# Altium project Busmaster.PrjPcb
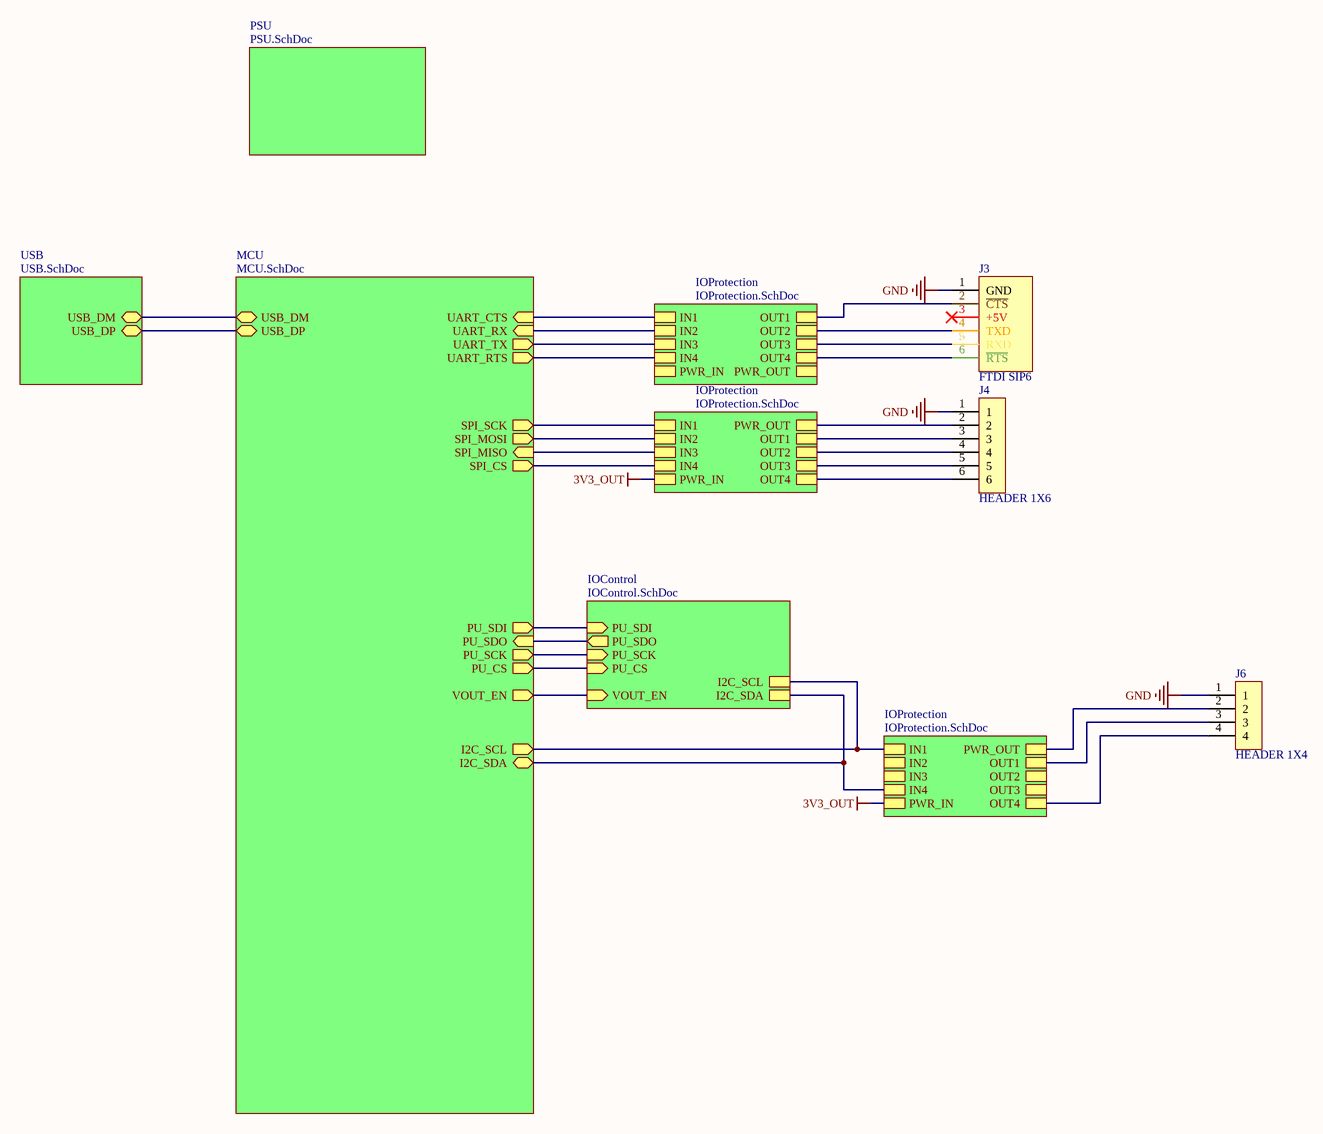
[diagram p0: Busmaster.SchDoc]
Project_Revision: 1.0; Project_Board_Name: Busmaster
6 sheets, 59 parts. Net scope: hierarchical (ports join the sheet entries above them; power ports are global).
Board file: Busmaster.PcbDoc
Sheets:
  Busmaster.SchDoc
    MCU = MCU.SchDoc
    PSU = PSU.SchDoc
    USB = USB.SchDoc
    IOProtection = IOProtection.SchDoc
    IOProtection = IOProtection.SchDoc
    IOProtection = IOProtection.SchDoc
    IOControl = IOControl.SchDoc

## Sheet Busmaster.SchDoc: Top Level
size A3; CompanyName: NOT USED; SheetNumber: 0; SheetTotal: 0; PageSetup: Record=PageOptions|CenterHorizontal=True|CenterVertical=True|PrintScale=1.00|XCorrection=1.00|YCorrection=1.00|PrintKind=0|BorderSize=5000000|LeftOffset=0|BottomOffset=0|Orientation=2|PaperLength=1000|PaperWidth=1000|Scale=100|PaperSource=7|PrintQuality=-4|MediaType=1|DitherType=10|PaperKind=A3|PrintScaleMode=0

### Parts
J3  FTDI SIP6  [HIROSE_A2-6PA-2.54DSA]
J4  HEADER 1X6  [HIROSE_A2-6PA-2.54DSA]
J6  HEADER 1X4  [HIROSE_A2-4PA-2.54DSA]

### Sub-sheets
IOControl = IOControl.SchDoc: VOUT_EN (in), I2C_SCL, I2C_SDA, PU_SDI (in), PU_SDO (out), PU_CS (in), PU_SCK (in)
IOProtection = IOProtection.SchDoc: IN2, OUT4, IN1, OUT1, IN3, IN4, OUT2, OUT3, PWR_IN, PWR_OUT
IOProtection = IOProtection.SchDoc: IN2, OUT4, IN1, OUT1, IN3, IN4, OUT2, OUT3, PWR_IN, PWR_OUT
IOProtection = IOProtection.SchDoc: IN2, OUT4, IN1, OUT1, IN3, IN4, OUT2, OUT3, PWR_OUT, PWR_IN
MCU = MCU.SchDoc: USB_DM (bidir), UART_CTS (in), SPI_CS (out), USB_DP (bidir), I2C_SCL (out), I2C_SDA (bidir), UART_RX (in), SPI_MOSI (out), UART_RTS (out), SPI_MISO (in), UART_TX (out), SPI_SCK (out), VOUT_EN (out), PU_SDI (out), PU_SDO (in), PU_SCK (out), PU_CS (out)
PSU = PSU.SchDoc: no entries
USB = USB.SchDoc: USB_DM (bidir), USB_DP (bidir)

### Nets
3V3_OUT: sheet IOProtection/PWR_IN, sheet IOProtection/PWR_IN
GND: J3.1(GND) J4.1 J6.1
NetC10_1#2_2: J6.2 ; sheet IOProtection/PWR_OUT
NetC10_2_2: J4.2 ; sheet IOProtection/PWR_OUT
NetD2_4: sheet MCU/USB_DP, sheet USB/USB_DP
NetD2_6: sheet MCU/USB_DM, sheet USB/USB_DM
NetD4_1_1: sheet MCU/I2C_SCL, sheet IOProtection/IN1, sheet IOControl/I2C_SCL
NetD4_1_3: sheet MCU/I2C_SDA, sheet IOProtection/IN4, sheet IOControl/I2C_SDA
NetD4_2_1: sheet MCU/SPI_SCK, sheet IOProtection/IN1
NetD4_2_3: sheet MCU/SPI_CS, sheet IOProtection/IN4
NetD4_2_4: sheet MCU/SPI_MISO, sheet IOProtection/IN3
NetD4_2_6: sheet MCU/SPI_MOSI, sheet IOProtection/IN2
NetD4_3_1: sheet MCU/UART_CTS, sheet IOProtection/IN1
NetD4_3_3: sheet MCU/UART_RTS, sheet IOProtection/IN4
NetD4_3_4: sheet MCU/UART_TX, sheet IOProtection/IN3
NetD4_3_6: sheet MCU/UART_RX, sheet IOProtection/IN2
NetJ3_2: J3.2(~{CTS}) ; sheet IOProtection/OUT1
NetJ3_4: J3.4(TXD) ; sheet IOProtection/OUT2
NetJ3_5: J3.5(RXD) ; sheet IOProtection/OUT3
NetJ3_6: J3.6(~{RTS}) ; sheet IOProtection/OUT4
NetJ4_3: J4.3 ; sheet IOProtection/OUT1
NetJ4_4: J4.4 ; sheet IOProtection/OUT2
NetJ4_5: J4.5 ; sheet IOProtection/OUT3
NetJ4_6: J4.6 ; sheet IOProtection/OUT4
NetJ6_3: J6.3 ; sheet IOProtection/OUT1
NetJ6_4: J6.4 ; sheet IOProtection/OUT4
NetQ5_1: sheet MCU/VOUT_EN, sheet IOControl/VOUT_EN
NetU1_10: sheet MCU/PU_SDO, sheet IOControl/PU_SDO
NetU1_11: sheet MCU/PU_CS, sheet IOControl/PU_CS
NetU1_12: sheet MCU/PU_SCK, sheet IOControl/PU_SCK
NetU1_13: sheet MCU/PU_SDI, sheet IOControl/PU_SDI

Not connected (* = marked no-connect by the designer): J3 3(+5V)*

### Notes on the sheet
- Project
- Size:
- Date:
- A3
- Revision:
- Sheet
- of
- Lambo
- File:

### Library data of the parts
J3 = CON-10749-A: FTDI Serial Header; Manufacturer: Hirose Electric Co Ltd; Manufacturer Part Number: A2-6PA-2.54DSA(71); Contacts: 6; Pitch: 2.54mm; Rows: 1; Display_Name: FTDI SIP6; Type: Header; BWA PN: CON-10749-A; Schematic Symbol: FTDI_TTL_232R; Supplier 1: Digi-Key; Supplier Part Number 1: H123043-ND
J4 = CON-10040-A: CONN 6-pin 2.54mm pitch TH single row; Manufacturer: Hirose; Manufacturer Part Number: A2-6PA-2.54DSA; Contacts: 6; Rows: 1; Display_Name: HEADER 1X6; Pitch: 2.54mm; Type: HEADER; BWA PN: CON-10040-A; Schematic Symbol: HIROSE_A2-6PA-2.54DSA
J6 = CON-10039-A: CONN 4-pin 2.54mm pitch TH single row; Manufacturer: Hirose; Manufacturer Part Number: A2-4PA-2.54DSA; Contacts: 4; Rows: 1; Display_Name: HEADER 1X4; Pitch: 2.54mm; BWA PN: CON-10039-A; Schematic Symbol: HIROSE_A2-4PA-2.54DSA

## Sheet MCU.SchDoc: Top Level
size A3; CompanyName: NOT USED; SheetNumber: 0; SheetTotal: 0; PageSetup: Record=PageOptions|CenterHorizontal=True|CenterVertical=True|PrintScale=1.00|XCorrection=1.00|YCorrection=1.00|PrintKind=0|BorderSize=5000000|LeftOffset=0|BottomOffset=0|Orientation=2|PaperLength=1000|PaperWidth=1000|Scale=100|PaperSource=7|PrintQuality=-4|MediaType=1|DitherType=10|PaperKind=A3|PrintScaleMode=0
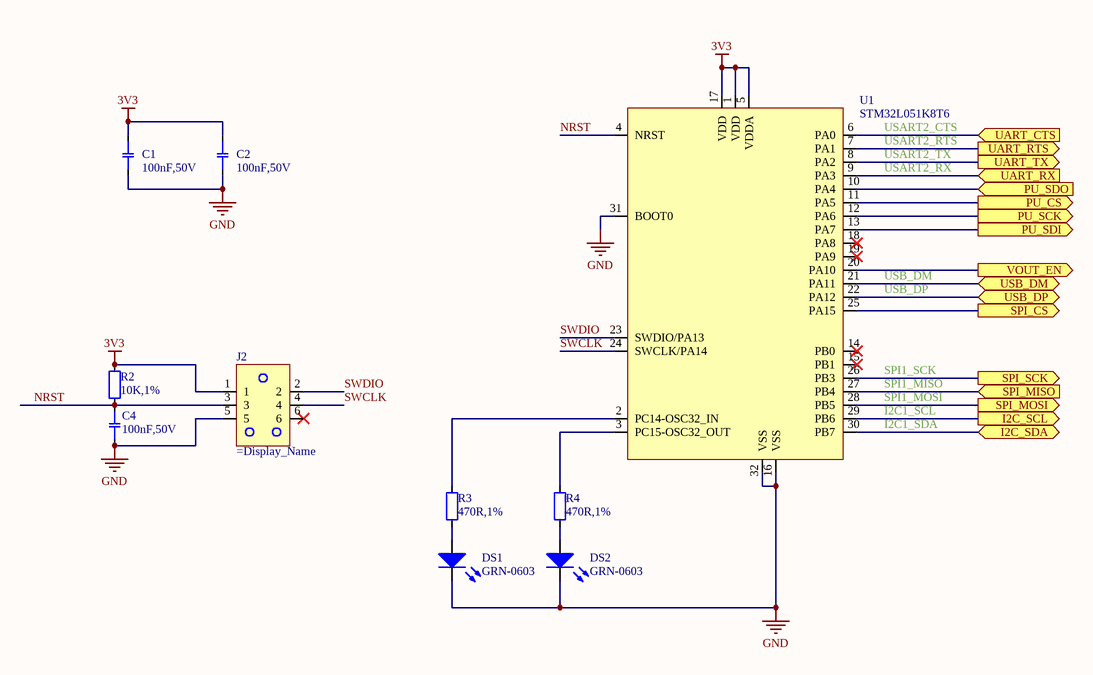
[diagram p1: MCU.SchDoc]

### Parts
C1  100nF,50V  [CAPC1608X09N_0603]
C2  100nF,50V  [CAPC1608X09N_0603]
C4  100nF,50V  [CAPC1608X09N_0603]
DS1  GRN-0603  [LED_SML-LX0603]
DS2  GRN-0603  [LED_SML-LX0603]
J2  (no value)  [TAG-CONNECT_TC2030-IDC]  (no BOM)
R2  10K,1%  [RESC1608X06N_0603]
R3  470R,1%  [RESC1608X06N_0603]
R4  470R,1%  [RESC1608X06N_0603]
U1  STM32L051K8T6  [LQFP32]

### Ports
I2C_SCL (out), I2C_SDA (bidir), PU_CS (out), PU_SCK (out), PU_SDI (out), PU_SDO (in), SPI_CS (out), SPI_MISO (in), SPI_MOSI (out), SPI_SCK (out), UART_CTS (in), UART_RTS (out), UART_RX (in), UART_TX (out), USB_DM (bidir), USB_DP (bidir), VOUT_EN (out)

### Nets
3V3: C1.2 C2.2 J2.1 R2.2 U1.1(VDD) U1.5(VDDA) U1.17(VDD)
GND: C1.1 C2.1 C4.2 DS1.1(C) DS2.1(C) J2.5 U1.16(VSS) U1.31(BOOT0) U1.32(VSS)
NRST: C4.1 J2.3 R2.1 U1.4(NRST)
SWCLK: J2.4 U1.24(SWCLK/PA14)
SWDIO: J2.2 U1.23(SWDIO/PA13)
NetD2_4: U1.22(PA12) ; port USB_DP
NetD2_6: U1.21(PA11) ; port USB_DM
NetD4_1_1: U1.29(PB6) ; port I2C_SCL
NetD4_1_3: U1.30(PB7) ; port I2C_SDA
NetD4_2_1: U1.26(PB3) ; port SPI_SCK
NetD4_2_3: U1.25(PA15) ; port SPI_CS
NetD4_2_4: U1.27(PB4) ; port SPI_MISO
NetD4_2_6: U1.28(PB5) ; port SPI_MOSI
NetD4_3_1: U1.6(PA0) ; port UART_CTS
NetD4_3_3: U1.7(PA1) ; port UART_RTS
NetD4_3_4: U1.8(PA2) ; port UART_TX
NetD4_3_6: U1.9(PA3) ; port UART_RX
NetDS1_2: DS1.2(A) R3.1
NetDS2_2: DS2.2(A) R4.1
NetQ5_1: U1.20(PA10) ; port VOUT_EN
NetR3_2: R3.2 U1.2(PC14-OSC32_IN)
NetR4_2: R4.2 U1.3(PC15-OSC32_OUT)
NetU1_10: U1.10(PA4) ; port PU_SDO
NetU1_11: U1.11(PA5) ; port PU_CS
NetU1_12: U1.12(PA6) ; port PU_SCK
NetU1_13: U1.13(PA7) ; port PU_SDI

Not connected (* = marked no-connect by the designer): J2 6*; U1 14(PB0)* 15(PB1)* 18(PA8)* 19(PA9)*

### Notes on the sheet
- (near U1) USART2_CTS
- (near U1) USART2_RTS
- (near U1) USART2_TX
- (near U1) USART2_RX
- (near U1) USB_DM
- (near U1) USB_DP
- (near U1) SPI1_SCK
- (near U1) SPI1_MISO
- (near U1) SPI1_MOSI
- (near U1) I2C1_SCL
- (near U1) I2C1_SDA
- Project
- Size:
- Date:
- A3
- Revision:
- Sheet
- of
- Lambo
- File:

### Library data of the parts
C1 C2 C4 = CCH-104CH-G: CAP CER 0.1UF 50V 10% X7R 0603; Manufacturer: Kemet; Manufacturer Part Number: C0603C104K5RACTU; Type: Ceramic; Display_Name: 100nF,50V; Capacitance: 100nF; Dielectric: X7R; Tolerance: 10%; Voltage: 50V; BWA PN: CCH-104CH-G; Schematic Symbol: CAP-NP_1; Supplier 1: Digi-Key; Supplier Part Number 1: 399-5089-1-ND
DS1 DS2 = LED-10087-A: LED GREEN CLEAR 0603 SMD; Manufacturer: Dialight; Manufacturer Part Number: 5988081107F; Wavelength: 523nm; Axial Intensity: 300mcd; If(max): 20mA; Lens Style/Size: 0603; Vf@I: 3.2V; Viewing Angle: 140; Display_Name: GRN-0603; BWA PN: LED-10087-A; Colour: GREEN; Lens type: clear; Vr(max): -; Schematic Symbol: LED_1; Supplier 1: Digi-Key; Supplier Part Number 1: 350-2036-1-ND
J2 = NONPART-051: Tag connect 6 way; Schematic Symbol: TAGCON_TC2030-IDC; BWA PN: NONPART-051
R2 = RSH-10K00-D: RES 10.0K OHM 1/10W 1% 0603 SMD; Manufacturer: Yageo; Manufacturer Part Number: RC0603FR-0710KL; Power: 0.1W; Display_Name: 10K,1%; Resistance: 10K; Tolerance: 1%; Type: Chip; BWA PN: RSH-10K00-D; Schematic Symbol: RESISTOR_1; Supplier 1: Digi-Key; Supplier Part Number 1: 311-10.0KHRCT-ND
R3 R4 = RSH-470R0-D: RES 470 OHM 1/10W 1% 0603 SMD; Manufacturer: Rohm Semiconductor; Manufacturer Part Number: MCR03EZPFX4700; Power: 0.1W; Display_Name: 470R,1%; Resistance: 470R; Tolerance: 1%; Type: Chip; BWA PN: RSH-470R0-D; Schematic Symbol: RESISTOR_1; Supplier 1: Digi-Key; Supplier Part Number 1: RHM470HCT-ND
U1 = ICT-10696-A: 32 Bit Mcirocontroler; Manufacturer: ST Microelectronics; Temp Range: -40°C ~ 85°C; Display_Name: STM32L051K8T6; BWA PN: ICT-10696-A; Schematic Symbol: STM32L051x6/8; Manufacturer Part Number: STM32L051K8T6; Supplier 1: Digi-Key; Supplier Part Number 1: 497-14901-ND

## Sheet PSU.SchDoc: Top Level
size A3; CompanyName: NOT USED; SheetNumber: 0; SheetTotal: 0; PageSetup: Record=PageOptions|CenterHorizontal=True|CenterVertical=True|PrintScale=1.00|XCorrection=1.00|YCorrection=1.00|PrintKind=0|BorderSize=5000000|LeftOffset=0|BottomOffset=0|Orientation=2|PaperLength=1000|PaperWidth=1000|Scale=100|PaperSource=7|PrintQuality=-4|MediaType=1|DitherType=10|PaperKind=A3|PrintScaleMode=0
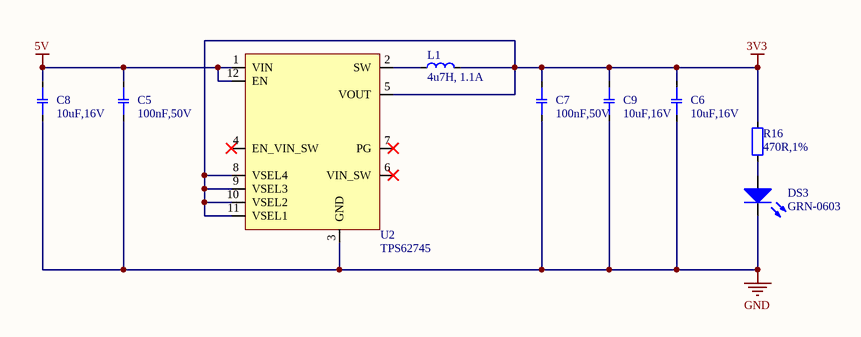
[diagram p2: PSU.SchDoc]

### Parts
C5  100nF,50V  [CAPC1608X09N_0603]
C6  10uF,16V  [CAPC2012X12N_0805]
C7  100nF,50V  [CAPC1608X09N_0603]
C8  10uF,16V  [CAPC2012X12N_0805]
C9  10uF,16V  [CAPC2012X12N_0805]
DS3  GRN-0603  [LED_SML-LX0603]
L1  4u7H, 1.1A  [INDC2520X12N_1008]
R16  470R,1%  [RESC1608X06N_0603]
U2  TPS62745  [R-PWSON-N12]

### Nets
3V3: C6.2 C7.2 C9.2 L1.2 R16.2 U2.5(VOUT) U2.8(VSEL4) U2.9(VSEL3) U2.10(VSEL2) U2.11(VSEL1)
5V: C5.2 C8.2 U2.1(VIN) U2.12(EN)
GND: C5.1 C6.1 C7.1 C8.1 C9.1 DS3.1(C) U2.3(GND)
NetDS3_2: DS3.2(A) R16.1
NetL1_1: L1.1 U2.2(SW)

Not connected (* = marked no-connect by the designer): U2 4(EN_VIN_SW)* 6(VIN_SW)* 7(PG)*

### Notes on the sheet
- Project
- Size:
- Date:
- A3
- Revision:
- Sheet
- of
- Lambo
- File:

### Library data of the parts
C5 C7 = CCH-104CH-G: as C1 on sheet MCU; Display_Name: 100nF,50V; Capacitance: 100nF; Dielectric: X7R; Tolerance: 10%; Voltage: 50V; BWA PN: CCH-104CH-G; Schematic Symbol: CAP-NP_1; Supplier 1: Digi-Key; Supplier Part Number 1: 399-5089-1-ND
C6 C8 C9 = CCI-106CD-G: CAP CER 10µF ±10% 16V X7R 0805; Manufacturer: Samsung Electro-Mechanics America, Inc.; Manufacturer Part Number: CL21B106KOQNNNG; Type: Ceramic; Display_Name: 10uF,16V; Capacitance: 10uF; Dielectric: X7R; Tolerance: 10%; Voltage: 16V; BWA PN: CCI-106CD-G; Schematic Symbol: CAP-NP_1; Supplier 1: Digi-Key; Supplier Part Number 1: 1276-6472-1-ND
DS3 = LED-10087-A: as DS1 on sheet MCU; Display_Name: GRN-0603; BWA PN: LED-10087-A; Colour: GREEN; Lens type: clear; Vr(max): -; Schematic Symbol: LED_1; Supplier 1: Digi-Key; Supplier Part Number 1: 350-2036-1-ND
L1 = IND-10165-A: INDUCTOR POWER 4.7UH 1.1A SMD; Manufacturer: Murata Electronics North America; Manufacturer Part Number: DFE252010R-H-4R7M=P2; Sheilding: Unsheilded; Type: Wirewound; DC Resistance: 276mOhm; Display_Name: 4u7H, 1.1A; Inductance: 4u7H; BWA PN: IND-10165-A; Current Rating: 1.1A; Schematic Symbol: INDUCTOR_1; Supplier 1: Digi-Key; Supplier Part Number 1: 490-10646-1-ND
R16 = RSH-470R0-D: as R3 on sheet MCU; Display_Name: 470R,1%; Resistance: 470R; Tolerance: 1%; Type: Chip; BWA PN: RSH-470R0-D; Schematic Symbol: RESISTOR_1; Supplier 1: Digi-Key; Supplier Part Number 1: RHM470HCT-ND
U2 = ICT-10699-A: Step Down Converter; Manufacturer: Texas Instruments; Temp Range: -40°C ~ 85°C; Display_Name: TPS62745; BWA PN: ICT-10699-A; Schematic Symbol: TPS62745; Manufacturer Part Number: TPS62745; Supplier 1: Digi-Key; Supplier Part Number 1: 296-44339-1-ND; Supplier 2: Element 14; Supplier Part Number 2: 2498474

## Sheet USB.SchDoc: Top Level
size A3; CompanyName: NOT USED; SheetNumber: 0; SheetTotal: 0; PageSetup: Record=PageOptions|CenterHorizontal=True|CenterVertical=True|PrintScale=1.00|XCorrection=1.00|YCorrection=1.00|PrintKind=0|BorderSize=5000000|LeftOffset=0|BottomOffset=0|Orientation=2|PaperLength=1000|PaperWidth=1000|Scale=100|PaperSource=7|PrintQuality=-4|MediaType=1|DitherType=10|PaperKind=A3|PrintScaleMode=0
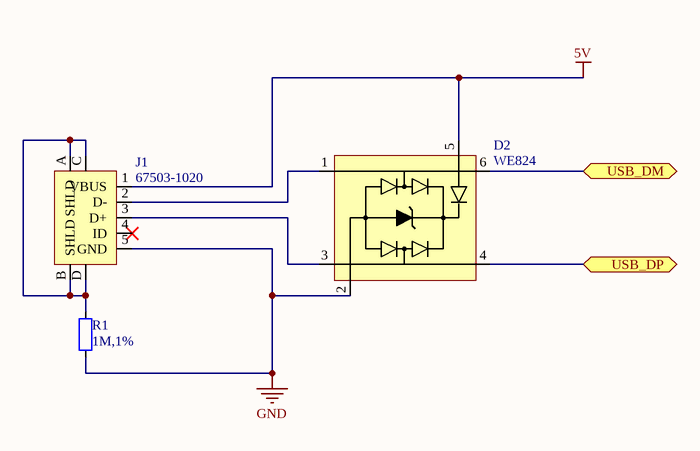
[diagram p3: USB.SchDoc]

### Parts
D2  WE824  [SOT95P280X145-6N_SOT23-6]
J1  67503-1020  [MOLEX_0675031020]
R1  1M,1%  [RESC1608X06N_0603]

### Ports
USB_DM (bidir), USB_DP (bidir)

### Nets
5V: D2.5 J1.1(VBUS)
GND: D2.2 J1.5(GND) R1.1
NetD2_1: D2.1 J1.2(D-)
NetD2_3: D2.3 J1.3(D+)
NetD2_4: D2.4 ; port USB_DP
NetD2_6: D2.6 ; port USB_DM
NetJ1_A: J1.A(SHLD) J1.B(SHLD) J1.C(SHLD) J1.D(SHLD) R1.2

Not connected (* = marked no-connect by the designer): J1 4(ID)*

### Notes on the sheet
- Project
- Size:
- Date:
- A3
- Revision:
- Sheet
- of
- Lambo
- File:

### Library data of the parts
D2 = DIO-10181-A: TVS DIODE 5VWM 7.7VC SOT23; Manufacturer: Wurth Electronics Inc; Manufacturer Part Number: 82400102; Vr(max): 5V; Display_Name: WE824; Type: TVS; BWA PN: DIO-10181-A; Schematic Symbol: WE824; Supplier 1: Digi-Key; Supplier Part Number 1: 732-4473-1-ND
J1 = CON-10519-A: CONN RECEPT MINIUSB R/A 5POS SMD; Manufacturer: Molex Connector Corporation; Manufacturer Part Number: 067503-1020; Contacts: 5; Pitch: 0.8; Rows: 1; Display_Name: 67503-1020; Series: 67503; Type: Receptacle; BWA PN: CON-10519-A; Schematic Symbol: MOLEX_0675031020; Supplier 1: Digi-Key; Supplier Part Number 1: WM5461CT-ND
R1 = RSH-1M000-D: RES 1.00M OHM 1/10W 1% 0603 SMD; Manufacturer: Yageo; Manufacturer Part Number: RC0603FR-071ML; Power: 0.1W; Display_Name: 1M,1%; Resistance: 1M; Tolerance: 1%; Type: Chip; BWA PN: RSH-1M000-D; Schematic Symbol: RESISTOR_1; Supplier 1: Digi-Key; Supplier Part Number 1: 311-1.00MHRCT-ND

## Sheet IOProtection.SchDoc: Top Level
size A3; CompanyName: NOT USED; SheetNumber: 0; SheetTotal: 0; PageSetup: Record=PageOptions|CenterHorizontal=True|CenterVertical=True|PrintScale=1.00|XCorrection=1.00|YCorrection=1.00|PrintKind=0|BorderSize=5000000|LeftOffset=0|BottomOffset=0|Orientation=2|PaperLength=1000|PaperWidth=1000|Scale=100|PaperSource=7|PrintQuality=-4|MediaType=1|DitherType=10|PaperKind=A3|PrintScaleMode=0
Used 3 times, as channels IOProtection, IOProtection, IOProtection. Parts and nets are listed once, with the designators drawn on the sheet.
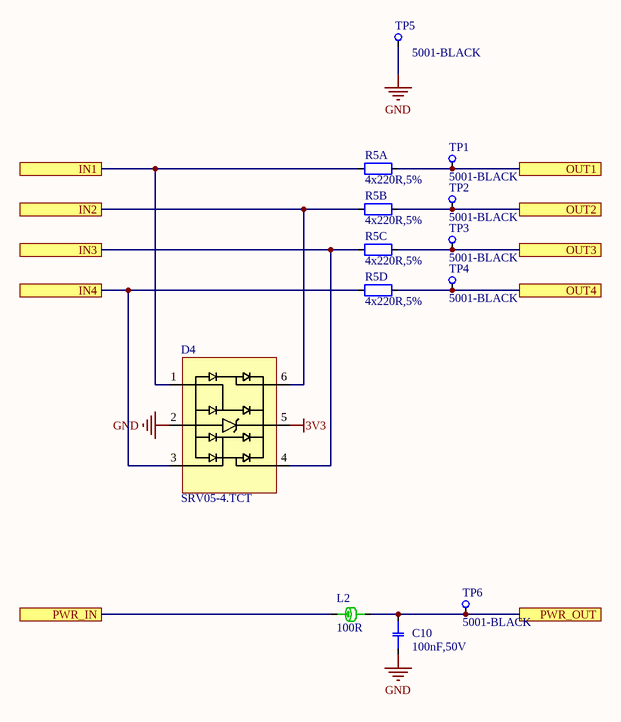
[diagram p4: IOProtection.SchDoc]

### Parts
C10  100nF,50V  [CAPC1608X09N_0603]
D4  SRV05-4.TCT  [SOT95P280X145-6N_SOT23-6]
L2  100R  [INDC1608X10N_0603]
R5  4x220R,5%  [RESCAF80P32X16X60N]  (parts A,B,C,D of 4)
TP1  5001-BLACK  [TP_5002]  (no BOM)
TP2  5001-BLACK  [TP_5002]  (no BOM)
TP3  5001-BLACK  [TP_5002]  (no BOM)
TP4  5001-BLACK  [TP_5002]  (no BOM)
TP5  5001-BLACK  [TP_5002]  (no BOM)
TP6  5001-BLACK  [TP_5002]  (no BOM)

### Ports
IN1, IN2, IN3, IN4, OUT1, OUT2, OUT3, OUT4, PWR_IN, PWR_OUT

### Nets
3V3: D4.5
GND: C10.1 D4.2 TP5.1
IN1: D4.1 R5.1 ; port IN1
IN2: D4.6 R5.2 ; port IN2
IN3: D4.4 R5.3 ; port IN3
IN4: D4.3 R5.4 ; port IN4
OUT1: R5.8 TP1.1 ; port OUT1
OUT2: R5.7 TP2.1 ; port OUT2
OUT3: R5.6 TP3.1 ; port OUT3
OUT4: R5.5 TP4.1 ; port OUT4
PWR_IN: L2.1 ; port PWR_IN
PWR_OUT: C10.2 L2.2 TP6.1 ; port PWR_OUT

### Channels
IOProtection: designators C10=C10_1#1 D4=D4_3 L2=L2_1#1 R5=R5_3 TP1=TP1_3 TP2=TP2_3 TP3=TP3_3#1 TP4=TP4_3#1 TP5=TP5_3 TP6=TP6_1#1; ports IN1=NetD4_3_1 IN2=NetD4_3_6 IN3=NetD4_3_4 IN4=NetD4_3_3 OUT1=NetJ3_2 OUT2=NetJ3_4 OUT3=NetJ3_5 OUT4=NetJ3_6 PWR_IN=NetL2_1#1_1 PWR_OUT=NetC10_1#1_2
IOProtection: designators end in _2; ports IN1=NetD4_2_1 IN2=NetD4_2_6 IN3=NetD4_2_4 IN4=NetD4_2_3 OUT1=NetJ4_3 OUT2=NetJ4_4 OUT3=NetJ4_5 OUT4=NetJ4_6 PWR_IN=3V3_OUT PWR_OUT=NetC10_2_2
IOProtection: designators C10=C10_1#2 D4=D4_1 L2=L2_1#2 R5=R5_1 TP1=TP1_1 TP2=TP2_1 TP3=TP3_3#2 TP4=TP4_3#2 TP5=TP5_1 TP6=TP6_1#2; ports IN1=NetD4_1_1 IN2=NetD4_1_6 IN3=NetD4_1_4 IN4=NetD4_1_3 OUT1=NetJ6_3 OUT2=NetR5_1_7 OUT3=NetR5_1_6 OUT4=NetJ6_4 PWR_IN=3V3_OUT PWR_OUT=NetC10_1#2_2

### Notes on the sheet
- Project
- Size:
- Date:
- A3
- Revision:
- Sheet
- of
- Lambo
- File:

### Library data of the parts
C10 = CCH-104CH-G: as C1 on sheet MCU; Display_Name: 100nF,50V; Capacitance: 100nF; Dielectric: X7R; Tolerance: 10%; Voltage: 50V; BWA PN: CCH-104CH-G; Schematic Symbol: CAP-NP_1; Supplier 1: Digi-Key; Supplier Part Number 1: 399-5089-1-ND
D4 = DIO-10080-A: IC TVS ARRAY 4-LINE 5V SOT23-6; Manufacturer: Semtech; Display_Name: SRV05-4.TCT; Type: TVS; BWA PN: DIO-10080-A; Schematic Symbol: SRV05-4.TCT; Manufacturer Part Number: SRV05-4.TCT; Supplier 1: Digi-Key; Supplier Part Number 1: SRV05-4CT-ND
L2 = IND-10168-A: FERRITE BEAD 100 OHM 0603 1LN; Manufacturer: Murata; Manufacturer Part Number: BLM18EG101TN1D; Inductance: 100Ohm @ 100 MHz; Current Rating: 2000mA; DC Resistance: 45mOhm; Schematic Symbol: INDUCTOR_1; Display_Name: 100R; BWA PN: IND-10168-A; Supplier 1: Digi-Key; Supplier Part Number 1: 490-5978-1-ND
R5 = RAB-200R0-F: RES ARRAY 220 OHM 8TRM 4 RES SMD; Manufacturer: Yageo; Manufacturer Part Number: YC164-JR-07220RL; Resistance: 220R; Display_Name: 4x220R,5%; Tolerance: 5%; Type: Array; BWA PN: RAB-200R0-F; Schematic Symbol: RESISTOR_ARRAY_4X; Supplier 1: Digi-Key; Supplier Part Number 1: YC164J-220CT-ND
TP1-TP6 = CON-10768-A: PC TEST LOOP BLACK; Manufacturer: Keystone Electronics; Manufacturer Part Number: 5000; Contacts: 1; Display_Name: 5001-BLACK; Rows: 1; Type: Testpoint; BWA PN: CON-10768-A; Schematic Symbol: TP_1; Supplier 1: Digi-Key; Supplier Part Number 1: 36-5001-ND

## Sheet IOControl.SchDoc: Top Level
size A3; CompanyName: NOT USED; SheetNumber: 0; SheetTotal: 0; PageSetup: Record=PageOptions|CenterHorizontal=True|CenterVertical=True|PrintScale=1.00|XCorrection=1.00|YCorrection=1.00|PrintKind=0|BorderSize=5000000|LeftOffset=0|BottomOffset=0|Orientation=2|PaperLength=1000|PaperWidth=1000|Scale=100|PaperSource=7|PrintQuality=-4|MediaType=1|DitherType=10|PaperKind=A3|PrintScaleMode=0
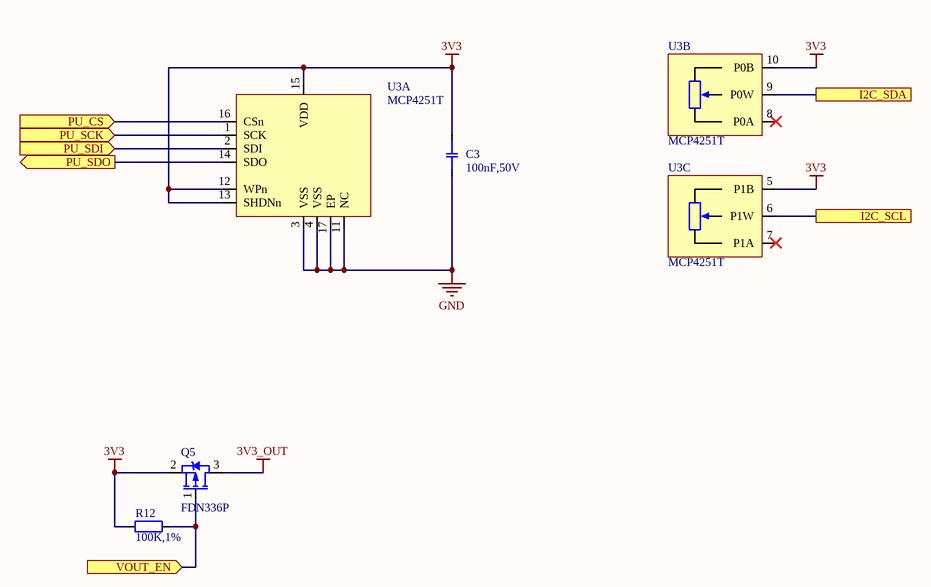
[diagram p5: IOControl.SchDoc]

### Parts
C3  100nF,50V  [CAPC1608X09N_0603]
Q5  FDN336P  [SOT95P230X110-3N_SOT23]
R12  100K,1%  [RESC1608X06N_0603]
U3  MCP4251T  [QFN65P400X400X90_HS-16N]  (parts A,B,C of 3)

### Ports
I2C_SCL, I2C_SDA, PU_CS (in), PU_SCK (in), PU_SDI (in), PU_SDO (out), VOUT_EN (in)

### Nets
3V3: C3.2 Q5.2(S) R12.2 U3.5(P1B) U3.10(P0B) U3.12(WPn) U3.13(SHDNn) U3.15(VDD)
3V3_OUT: Q5.3(D)
GND: C3.1 U3.3(VSS) U3.4(VSS) U3.11(NC) U3.17(EP)
NetD4_1_1: U3.6(P1W) ; port I2C_SCL
NetD4_1_3: U3.9(P0W) ; port I2C_SDA
NetQ5_1: Q5.1(G) R12.1 ; port VOUT_EN
NetU1_10: U3.14(SDO) ; port PU_SDO
NetU1_11: U3.16(CSn) ; port PU_CS
NetU1_12: U3.1(SCK) ; port PU_SCK
NetU1_13: U3.2(SDI) ; port PU_SDI

Not connected (* = marked no-connect by the designer): U3 7(P1A)* 8(P0A)*

### Notes on the sheet
- Project
- Size:
- Date:
- A3
- Revision:
- Sheet
- of
- Lambo
- File:

### Library data of the parts
C3 = CCH-104CH-G: as C1 on sheet MCU; Display_Name: 100nF,50V; Capacitance: 100nF; Dielectric: X7R; Tolerance: 10%; Voltage: 50V; BWA PN: CCH-104CH-G; Schematic Symbol: CAP-NP_1; Supplier 1: Digi-Key; Supplier Part Number 1: 399-5089-1-ND
Q5 = TRN-10046-A: MOSFET P-Channel; Manufacturer: Fairchild Semiconductor; Type: P; Id(max): 1.3A; rds(on): 200 mOhm @ 1.3A, 4.5V; Vds(max): 20V; Vgs(max): +/-8V; Vth(max): 1.5V @ 250µA; Display_Name: FDN336P; BWA PN: TRN-10046-A; Schematic Symbol: MOSFET-P_1; Manufacturer Part Number: FDN336P; Supplier 1: Digi-Key; Supplier Part Number 1: FDN336PCT-ND
R12 = RSH-100K0-D: RES 100K OHM 1/10W 1% 0603 SMD; Manufacturer: Yageo; Manufacturer Part Number: RC0603FR-07100KL; Power: 0.1W; Display_Name: 100K,1%; Resistance: 100K; Tolerance: 1%; Type: Chip; BWA PN: RSH-100K0-D; Schematic Symbol: RESISTOR_1; Supplier 1: Digi-Key; Supplier Part Number 1: 311-100KHRCT-ND
U3 = ICT-10921-A: IC DGTL POT 10KOHM 257TAP 16QFN; Manufacturer: Microchip Technology; Manufacturer Part Number: MCP4251T-103E/ML; Temp Range: -40°C ~ 125°C; Display_Name: MCP4251T; BWA PN: ICT-10921-A; Schematic Symbol: MCP4241T-103E; Supplier 1: Digi-Key; Supplier Part Number 1: MCP4251T-103E/MLCT-ND

## Nets that join several sheets
3V3: MCU (7 pins), PSU (10 pins), IOProtection (D4_3.5), IOProtection (D4_2.5), IOProtection (D4_1.5), IOControl (8 pins)
3V3_OUT: IOProtection (L2_2.1), IOProtection (L2_1#2.1), IOControl (Q5.3)
5V: PSU (C5.2 C8.2 U2.1 U2.12), USB (D2.5 J1.1)
GND: Busmaster (J3.1 J4.1 J6.1), MCU (9 pins), PSU (7 pins), USB (D2.2 J1.5 R1.1), IOProtection (C10_1#1.1 D4_3.2 TP5_3.1), IOProtection (C10_2.1 D4_2.2 TP5_2.1), IOProtection (C10_1#2.1 D4_1.2 TP5_1.1), IOControl (5 pins)
NetC10_1#2_2: Busmaster (J6.2), IOProtection (C10_1#2.2 L2_1#2.2 TP6_1#2.1)
NetC10_2_2: Busmaster (J4.2), IOProtection (C10_2.2 L2_2.2 TP6_2.1)
NetD2_4: MCU (U1.22), USB (D2.4)
NetD2_6: MCU (U1.21), USB (D2.6)
NetD4_1_1: MCU (U1.29), IOProtection (D4_1.1 R5_1.1), IOControl (U3.6)
NetD4_1_3: MCU (U1.30), IOProtection (D4_1.3 R5_1.4), IOControl (U3.9)
NetD4_2_1: MCU (U1.26), IOProtection (D4_2.1 R5_2.1)
NetD4_2_3: MCU (U1.25), IOProtection (D4_2.3 R5_2.4)
NetD4_2_4: MCU (U1.27), IOProtection (D4_2.4 R5_2.3)
NetD4_2_6: MCU (U1.28), IOProtection (D4_2.6 R5_2.2)
NetD4_3_1: MCU (U1.6), IOProtection (D4_3.1 R5_3.1)
NetD4_3_3: MCU (U1.7), IOProtection (D4_3.3 R5_3.4)
NetD4_3_4: MCU (U1.8), IOProtection (D4_3.4 R5_3.3)
NetD4_3_6: MCU (U1.9), IOProtection (D4_3.6 R5_3.2)
NetJ3_2: Busmaster (J3.2), IOProtection (R5_3.8 TP1_3.1)
NetJ3_4: Busmaster (J3.4), IOProtection (R5_3.7 TP2_3.1)
NetJ3_5: Busmaster (J3.5), IOProtection (R5_3.6 TP3_3#1.1)
NetJ3_6: Busmaster (J3.6), IOProtection (R5_3.5 TP4_3#1.1)
NetJ4_3: Busmaster (J4.3), IOProtection (R5_2.8 TP1_2.1)
NetJ4_4: Busmaster (J4.4), IOProtection (R5_2.7 TP2_2.1)
NetJ4_5: Busmaster (J4.5), IOProtection (R5_2.6 TP3_2.1)
NetJ4_6: Busmaster (J4.6), IOProtection (R5_2.5 TP4_2.1)
NetJ6_3: Busmaster (J6.3), IOProtection (R5_1.8 TP1_1.1)
NetJ6_4: Busmaster (J6.4), IOProtection (R5_1.5 TP4_3#2.1)
NetQ5_1: MCU (U1.20), IOControl (Q5.1 R12.1)
NetU1_10: MCU (U1.10), IOControl (U3.14)
NetU1_11: MCU (U1.11), IOControl (U3.16)
NetU1_12: MCU (U1.12), IOControl (U3.1)
NetU1_13: MCU (U1.13), IOControl (U3.2)

## Assembly variants
Default: not fitted J2 J3